# Altium project Panel2.PrjPCB
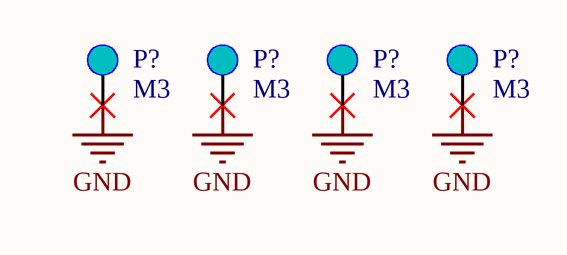
[diagram p0: Panel2.SchDoc]
1 sheet, 4 parts. Net scope: global (net labels, ports and power ports of the same name join across sheets).
Board file: Panel2.PcbDoc

## Sheet Panel2.SchDoc
size A4

### Parts
(Parts that share a designator on the sheet are numbered #1, #2 ... from top to bottom, then left to right.)
P?#1  M3  [M3_4.0]
P?#2  M3  [M3_4.0]
P?#3  M3  [M3_4.0]
P?#4  M3  [M3_4.0]

### Nets
GND: P?#1.1 P?#2.1 P?#3.1 P?#4.1